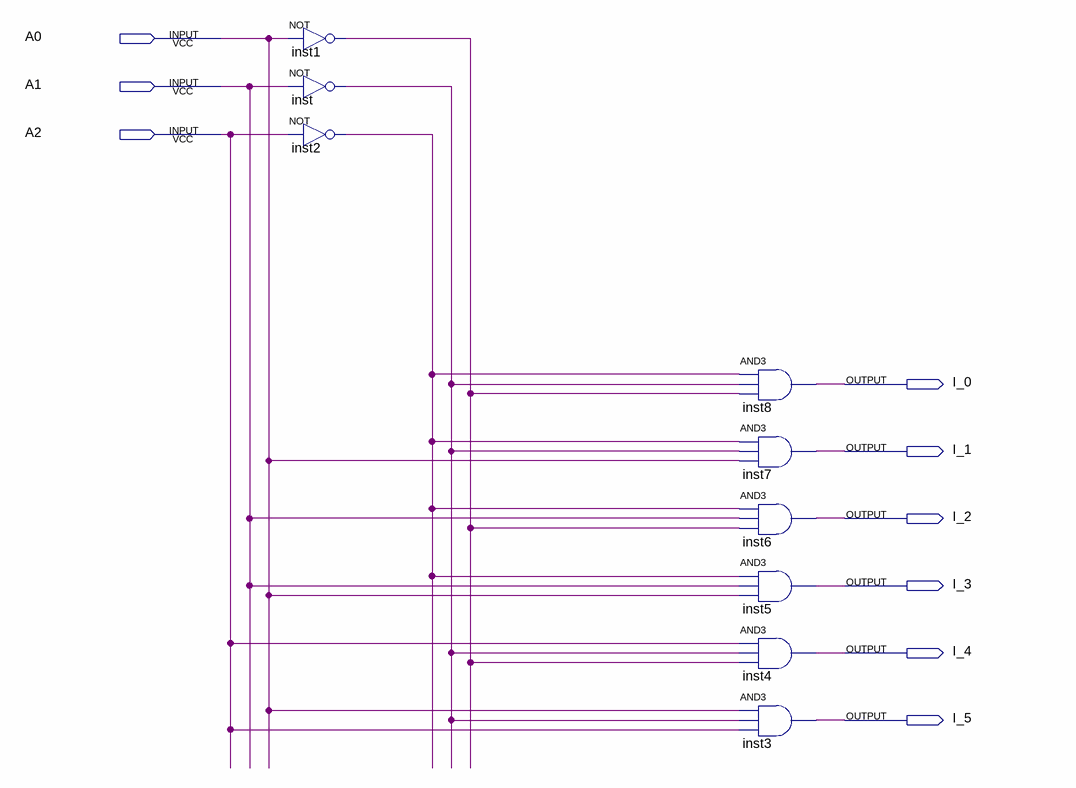
[diagram p0: schematic sheet]
// Quartus schematic DecAdr.bdf as structural Verilog: 9 symbols, 9 pins
module DecAdr (
  input  A0,
  input  A1,
  input  A2,
  output I_0,
  output I_1,
  output I_2,
  output I_3,
  output I_4,
  output I_5
);

  wire inst1_out, inst2_out, inst_out;

  not inst1 (inst1_out, A0);
  not inst (inst_out, A1);
  not inst2 (inst2_out, A2);
  and inst8 (I_0, inst2_out, inst_out, inst1_out);
  and inst7 (I_1, inst2_out, inst_out, A0);
  and inst6 (I_2, inst2_out, A1, inst1_out);
  and inst5 (I_3, inst2_out, A1, A0);
  and inst4 (I_4, A2, inst_out, inst1_out);
  and inst3 (I_5, A0, inst_out, A2);
endmodule
